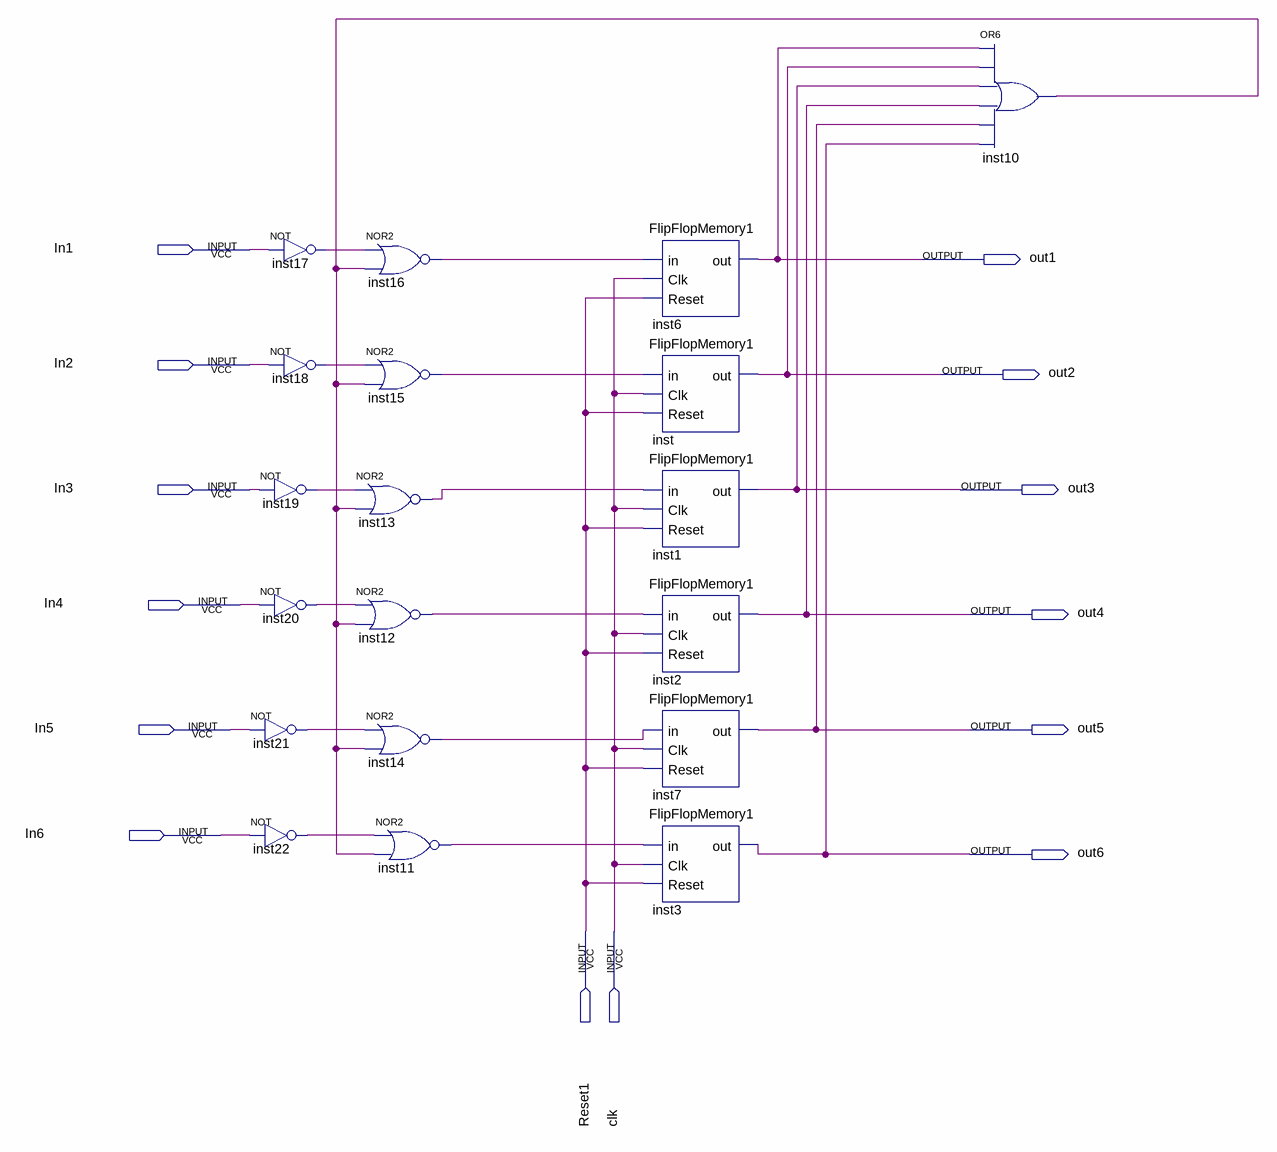
[diagram p0: schematic sheet]
// Quartus schematic Block4FFP.bdf as structural Verilog: 19 symbols, 14 pins
module Block4FFP (
  input  In1,
  input  In2,
  input  In3,
  input  In4,
  input  In5,
  input  In6,
  input  Reset1,
  input  clk,
  output out1,
  output out2,
  output out3,
  output out4,
  output out5,
  output out6
);

  wire inst10_out, inst11_out, inst12_out, inst13_out, inst14_out, inst15_out, inst16_out, inst17_out,
       inst18_out, inst19_out, inst20_out, inst21_out, inst22_out;

  not inst17 (inst17_out, In1);
  not inst18 (inst18_out, In2);
  not inst19 (inst19_out, In3);
  not inst20 (inst20_out, In4);
  not inst21 (inst21_out, In5);
  not inst22 (inst22_out, In6);
  nor inst16 (inst16_out, inst17_out, inst10_out);
  nor inst15 (inst15_out, inst18_out, inst10_out);
  nor inst13 (inst13_out, inst19_out, inst10_out);
  nor inst12 (inst12_out, inst20_out, inst10_out);
  nor inst14 (inst14_out, inst21_out, inst10_out);
  nor inst11 (inst11_out, inst22_out, inst10_out);
  FlipFlopMemory1 inst6 (.in(inst16_out), .Clk(clk), .Reset(Reset1), .out(out1));
  FlipFlopMemory1 inst (.in(inst15_out), .Clk(clk), .Reset(Reset1), .out(out2));
  FlipFlopMemory1 inst1 (.in(inst13_out), .Clk(clk), .Reset(Reset1), .out(out3));
  FlipFlopMemory1 inst2 (.in(inst12_out), .Clk(clk), .Reset(Reset1), .out(out4));
  FlipFlopMemory1 inst7 (.in(inst14_out), .Clk(clk), .Reset(Reset1), .out(out5));
  FlipFlopMemory1 inst3 (.in(inst11_out), .Clk(clk), .Reset(Reset1), .out(out6));
  or inst10 (inst10_out, out1, out2, out3, out4, out5, out6);
endmodule
